# EAGLE design qec_pcb_v3 (EAGLE 9.0.1)
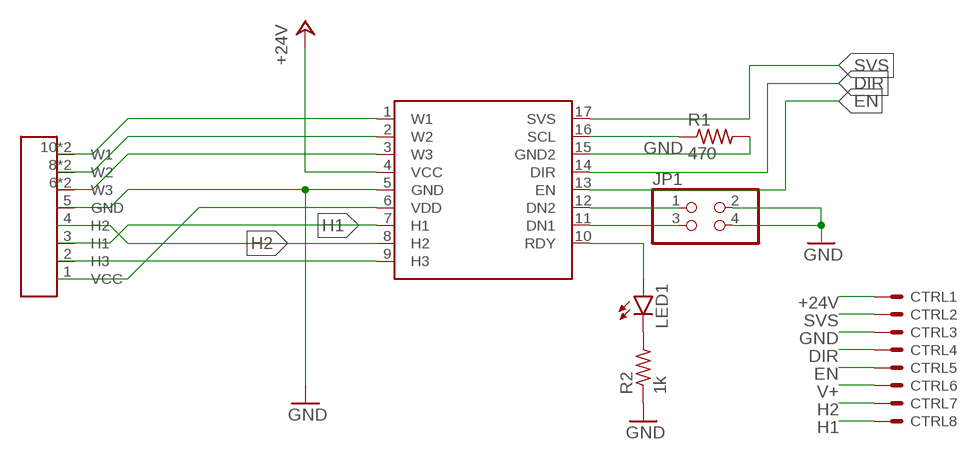
[diagram p0: schematic, sheet 1]

## Parts
CTRL  JST8  [JST]
JP1  PINHD-2X2  [2X02]
K1  68611114122  [68611114122]
LED1  LEDCHIPLED_0805  [CHIPLED_0805]
R1  470  R-US_M0805  [M0805]
R2  1k  R-US_M0805  [M0805]
U$1  1-Q-EC1-Q-EC-SMD  [1-Q-EC-SMD]

## Nets
+24V: CTRL.1 U$1.4(VCC)
DIR: CTRL.4 U$1.14(DIR)
EN: CTRL.5 U$1.13(EN)
GND: CTRL.3 JP1.2 JP1.4 K1.5(GND) R1.2 R2.1 U$1.5(GND) U$1.15(GND2)
H1: CTRL.8 K1.3(H1) U$1.7(H1)
H2: CTRL.7 K1.4(H2) U$1.8(H2)
N$1: LED1.C R2.2
N$2: LED1.A U$1.10(RDY)
N$3: JP1.1 U$1.12(DN2)
N$4: JP1.3 U$1.11(DN1)
N$5: K1.10(W1) K1.11(W1) U$1.1(W1)
N$6: R1.1 U$1.16(SCL)
N$11: K1.8(W2) K1.9(W2) U$1.2(W2)
N$12: K1.6(W3) K1.7(W3) U$1.3(W3)
N$16: K1.2(H3) U$1.9(H3)
SVS: CTRL.2 U$1.17(SVS)
V+: CTRL.6 K1.1(VCC) U$1.6(VDD)

## Library data of the parts
CTRL = dedo:JST8
JP1 = pinhead:PINHD-2X2: PIN HEADER
K1 = dedo:68611114122: WR-FPC 1.00mm SMT ZIF Horizontal Top Contact, 11 Pins=>Code : Con_FPC_ZIF_1.00_68611114122 <http://katalog.we-online.de/media/images/eican/Con_FPC_ZIF_1.00_6861xx14122_pf2.jpg> Details see: http://katalog.we-online.de/en/em/686_1xx_141_22 Created 2014-07-09, Karrer Zheng 2014 (C) Würth Elektronik
LED1 = led:LED: LED OSRAM: - CHIPLED LG R971, LG N971, LY N971, LG Q971, LY Q971, LO R971, LY R971 LH N974, LH R974 LS Q976, LO Q976, LY Q976 LO Q996 - Hyper CHIPLED LW Q18S LB Q993, LB Q99A, LB R99A - SideLED LS A670, LO A670, LY A670, LG A670, LP A670 LB A673, LV A673, LT A673, LW A673 LH A674 LY A675 LS A676, LA A676, LO A676, LY A676, LW A676 LS A679, LY A679, LG A679 - Hyper Micro SIDELED® LS Y876, LA Y876, LO Y876, LY Y876 LT Y87S - SmartLED LW L88C, LW L88S LB L89C, LB L89S, LG L890 LS L89K, LO L89K, LY L89K LS L896, LA L896, LO L896, LY L896 - TOPLED LS T670, LO T670, LY T670, LG T670, LP T670 LSG T670, LSP T670, LSY T670, LOP T670, LYG T670 LG T671, LOG T671, LSG T671 LB T673, LV T673, LT T673, LW T673 LH T674 LS T676, LA T676, LO T676, LY T676, LB T676, LH T676, LSB T676, LW T676 LB T67C, LV T67C, LT T67C, LS T67K, LO T67K, LY T67K, LW E67C LS E67B, LA E67B, LO E67B, LY E67B, LB E67C, LV E67C, LT E67C LW T67C LS T679, LY T679, LG T679 LS T770, LO T770, LY T770, LG T770, LP T770 LB T773, LV T773, LT T773, LW T773 LH T774 LS E675, LA E675, LY E675, LS T675 LS T776, LA T776, LO T776, LY T776, LB T776 LHGB T686 LT T68C, LB T68C - Hyper Mini TOPLED® LB M676 - Mini TOPLED Santana® LG M470 LS M47K, LO M47K, LY M47K Source: http://www.osram.convergy.de LUXEON: - LUMILED® LXK2-PW12-R00, LXK2-PW12-S00, LXK2-PW14-U00, LXK2-PW14-V00 LXK2-PM12-R00, LXK2-PM12-S00, LXK2-PM14-U00 LXK2-PE12-Q00, LXK2-PE12-R00, LXK2-PE12-S00, LXK2-PE14-T00, LXK2-PE14-U00 LXK2-PB12-K00, LXK2-PB12-L00, LXK2-PB12-M00, LXK2-PB14-N00, LXK2-PB14-P00, LXK2-PB14-Q00 LXK2-PR12-L00, LXK2-PR12-M00, LXK2-PR14-Q00, LXK2-PR14-R00 LXK2-PD12-Q00, LXK2-PD12-R00, LXK2-PD12-S00 LXK2-PH12-R00, LXK2-PH12-S00 LXK2-PL12-P00, LXK2-PL12-Q00, LXK2-PL12-R00 Source: www.luxeon.com KINGBRIGHT: KA-3528ASYC Source: www.kingbright.com
R1 R2 = resistor:R-US_: RESISTOR, American symbol
U$1 = dedo:1-Q-EC

## Board
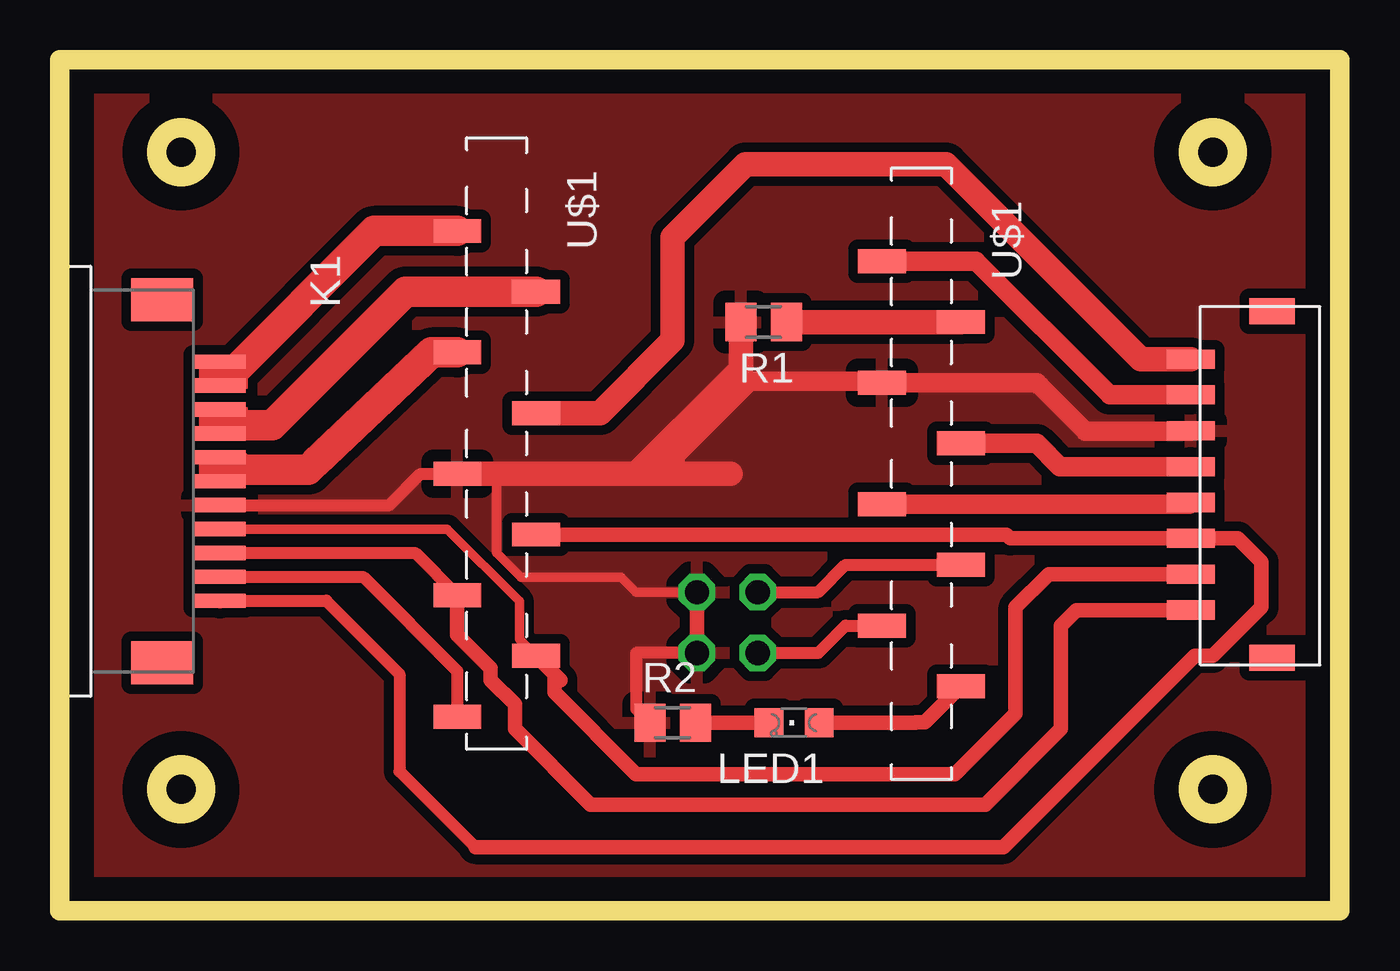
[diagram p1: board, top side]
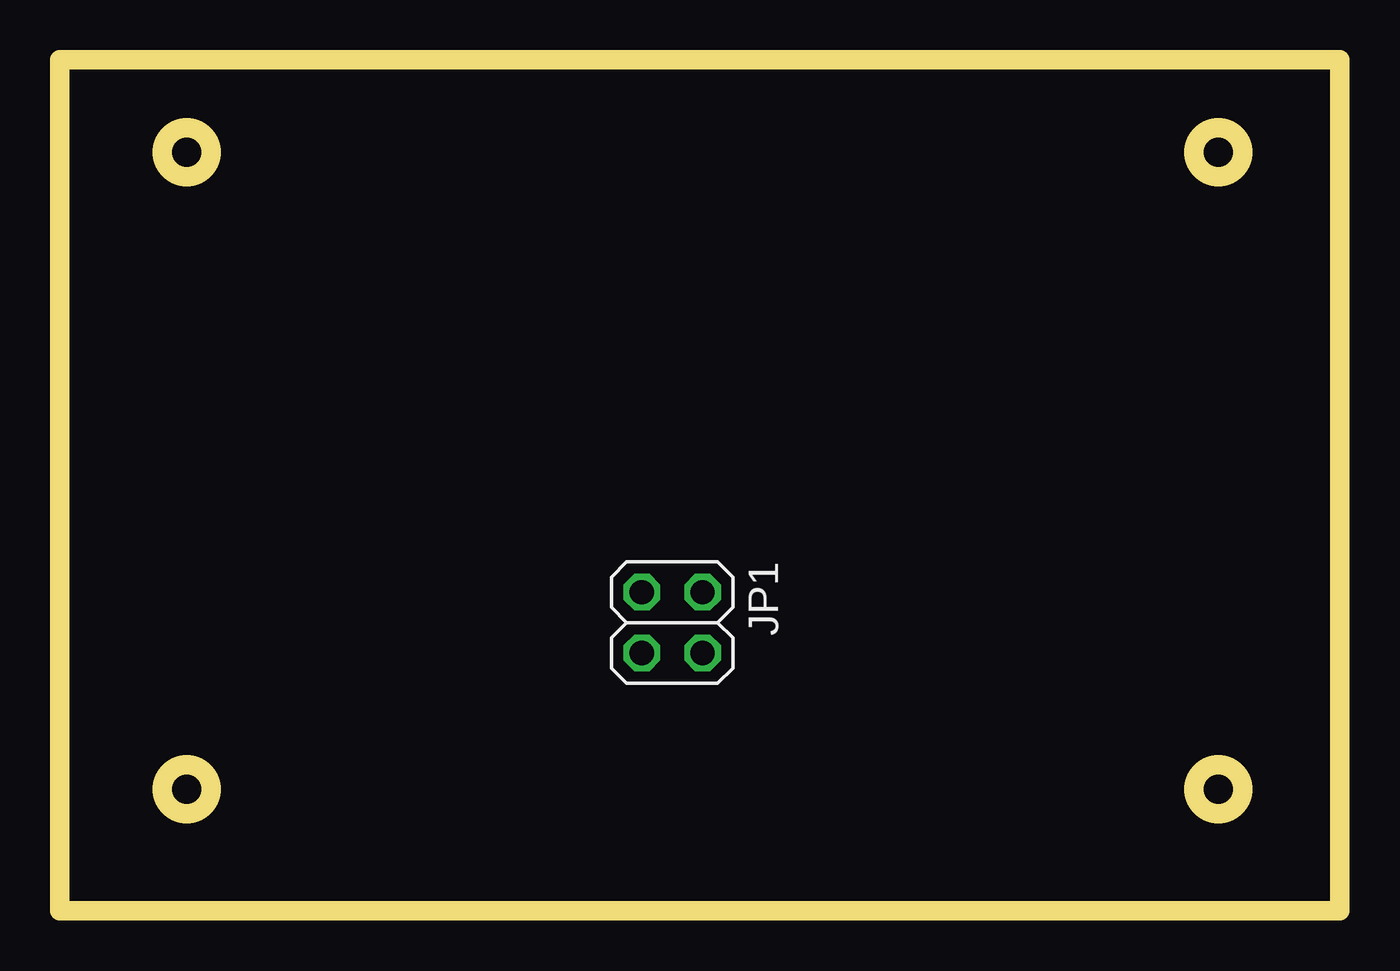
[diagram p2: board, bottom side, seen from below]

Size 53.57 x 35.61 mm. Coordinates in mm from the lower left corner, seen from the top.
Outline: 0,0 53.57,0 53.57,35.61 0,35.61 0,0
Outline: circle at 5.08,31.75 radius 1.02
Outline: circle at 48.26,31.75 radius 1.02
Outline: circle at 48.26,5.08 radius 1.02
Outline: circle at 5.08,5.08 radius 1.02
Copper layers (1*16): Top 0.035mm / dielectric 1.5mm / Bottom 0.035mm
Design rules "default *": minimum track width 6mil, minimum drill 0.35mm, track to track 6mil, track to pad 6mil, pad to pad 6mil, via to via 6mil, smd to smd 6mil, copper to edge 40mil, drill to drill 6mil, minimum pad ring 10mil, minimum via ring 8mil, stop-mask expansion 4mil, vias tented up to drill 0mil, thermal gap 20mil

### Footprints (pad centres in the part's own frame; a part is rotated, then mirrored left to right if it is on the bottom)
JST = smd 0.8 x 2: 1 -4.8,-2.7; 2 -3.3,-2.7; 3 -1.8,-2.7; 4 -0.3,-2.7; 5 1.2,-2.7; 6 2.7,-2.7; 7 4.2,-2.7; 8 5.7,-2.7 | smd 1.1 x 1.9: 9 -6.8,0.7; 10 7.7,0.7
2X02 = drill 1.016 octagon: 1 -1.27,-1.27; 2 -1.27,1.27; 3 1.27,-1.27; 4 1.27,1.27
68611114122 = smd 0.6 x 2.2: 1 1.5,1.1; 2 0.5,1.1; 3 -0.5,1.1; 4 -1.5,1.1; 5 -2.5,1.1; 6 -3.5,1.1; 7 -4.5,1.1; 8 -5.5,1.1; 9 -6.5,1.1; 10 -7.5,1.1; 11 -8.5,1.1 | smd 1.8 x 2.6: Z1 -11.1,-1.3; Z2 4.1,-1.3
CHIPLED_0805 = smd 1.2 x 1.2: A 0,-1.05; C 0,1.05
M0805 = smd 1.3 x 1.6: 1 -0.95,0; 2 0.95,0
1-Q-EC-SMD = smd 2 x 1: 1 -10.54,7.62; 2 -7.24,5.08; 3 -10.54,2.54; 4 -7.24,0; 5 -10.54,-2.54; 6 -7.24,-5.08; 7 -10.54,-7.62; 8 -7.24,-10.16; 9 -10.54,-12.7; 10 10.54,-11.43; 11 7.24,-8.89; 12 10.54,-6.35; 13 7.24,-3.81; 14 10.54,-1.27; 15 7.24,1.27; 16 10.54,3.81; 17 7.24,6.35

### Placement (x,y rotation side)
CTRL  50.04,18.29 270 top
JP1  27.94,12.06 270 bottom
K1  5.59,14.48 270 top
LED1  30.73,7.87 90 top
R1  29.46,24.64 180 top
R2  25.65,7.87 0 top
U$1  27.18,20.83 0 top

### Tracks (layer width: path | path; a pad name or v marks a point on that pad's centre or on a via)
+24V
  Top 1.016: U$1.4 22.61,20.83 25.65,23.88 25.65,28.19 28.7,31.24 37.08,31.24 45.24,23.09 CTRL.1
DIR
  Top 0.61: 38.61,19.56 U$1.14
  Top 0.813: U$1.14 40.89,19.56 41.86,18.59 CTRL.4
EN
  Top 0.813: U$1.13 47.27,17.02 CTRL.5
GND
  Top 0.406: JP1.2 24.13,13.34 23.5,13.97 19.3,13.97 18.29,14.99 18.29,18.29 | U$1.5 16.51,18.29
  Top 0.508: K1.5 13.8,16.98 15.11,18.29 16.51,18.29 | JP1.4 24.13,10.79 24.13,8.45 R2.1
  Top 0.61: JP1.2 JP1.4 | 40.89,22.1 41.02,21.97 | U$1.15 28.96,22.1 | 28.96,22.1 28.51,22.54 | 28.96,22.1 25.65,18.8
  Top 0.813: 41.02,21.97 42.93,20.07 47.32,20.07 CTRL.3 | 40.89,22.1 U$1.15 34.35,22.16 28,22.16
  Top 1.016: 16.51,18.29 18.29,18.29 24.13,18.29 | 25.15,18.29 28.07,18.29 | 28.51,22.54 28.51,22.67 | 28.51,22.67 R1.2 | 25.65,18.8 25.15,18.29 | 25.15,18.29 24.13,18.29 | 24.13,18.29 28,22.16 28.51,22.67
  pour Top (isolate 0.406): 0.25,0 53.59,0 53.59,35.43 0,35.43 0,-0.25
H1
  Top 0.508: K1.3 14.87,14.98 U$1.7 | 18.03,9.65 18.54,9.14
  Top 0.61: CTRL.8 42.56,12.59 41.91,11.94 41.91,7.62 38.73,4.45 22.23,4.45 19.05,7.62 19.05,8.64 18.03,9.65 18.03,10.16 16.64,11.56 U$1.7
H2
  Top 0.406: U$1.8 19.24,11.37 19.24,12.95 16.22,15.98 K1.4
  Top 0.61: CTRL.7 41.39,14.09 40.01,12.7 40.01,8.26 37.47,5.71 24.13,5.71 20.7,9.14 20.7,9.9 | U$1.8 20.7,9.9 | 20.7,9.9 20.95,9.65
N$1
  Top 0.61: LED1.C R2.2
N$2
  Top 0.61: LED1.A 35.81,7.87 35.84,7.9 36.22,7.9 U$1.10
N$3
  Top 0.508: JP1.1 31.75,13.34 32.89,14.48 36.83,14.48
  Top 0.61: 36.83,14.48 U$1.12
N$4
  Top 0.508: JP1.3 31.75,10.79 32.89,11.94 33.66,11.94
  Top 0.61: 33.66,11.94 U$1.11
N$5
  Top 0.508: K1.11 K1.10 7.09,22.38 8.1,23.39
  Top 1.27: U$1.1 13.16,28.45 7.09,22.38
N$6
  Top 1.016: U$1.16 R1.1
N$11
  Top 0.508: K1.8 6.69,20.32 K1.9 6.84,20.83 | 14.48,25.91 10.67,22.1
  Top 1.27: U$1.2 14.48,25.91 8.89,20.32 6.69,20.32
N$12
  Top 0.508: K1.6 K1.7 6.35,18.47 8.13,18.22 9.36,18.46
  Top 0.61: K1.6 7.31,18.6 7.62,18.91 6.35,18.47
  Top 1.27: U$1.3 15.57,23.37 10.67,18.72 10.41,18.46 9.36,18.46 7.45,18.46 7.31,18.6
N$16
  Top 0.508: K1.2 12.69,13.98 16.64,10.03 U$1.9
SVS
  Top 0.813: U$1.17 38.35,27.18 43.94,21.59 CTRL.2
V+
  Top 0.508: K1.1 11.15,12.98 14.22,9.91 14.22,5.84 17.4,2.67
  Top 0.61: K1.1 6.71,12.95 | U$1.6 39.62,15.75 39.78,15.59 CTRL.6 49.31,15.59 50.29,14.61 50.29,12.7 48.26,10.67 47.5,10.67 39.5,2.67 17.4,2.67
(copper drawn outside any net)
  shapes: Top area x3